# Altium project Bloco Motor.PrjPcb
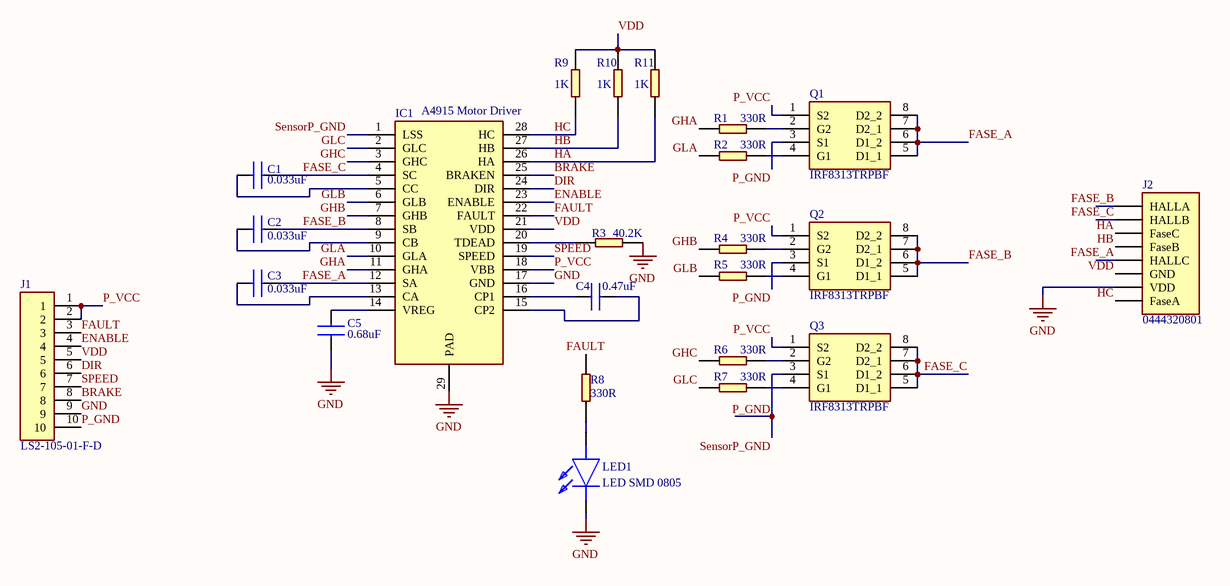
[diagram p0: BlocoMotor.SchDoc]
1 sheet, 23 parts. Net scope: global (net labels, ports and power ports of the same name join across sheets).
Board files: BlocoMotorFinal.PcbDoc, BlocoMotorReto.PcbDoc

## Sheet BlocoMotor.SchDoc
size A4; System: Connector

### Parts
C1  0.033uF  [CAP0805 50v]
C2  0.033uF  [CAP0805 50v]
C3  0.033uF  [CAP0805 50v]
C4  0.47uF  [CAP0805 50v]
C5  0.68uF  [CAP0805 50v]
IC1  A4915 Motor Driver  [A4915 Motor Driver]
J1  LS2-105-01-F-D  [CONN SINAL 10POS]
J2  0444320801  [CONN Main Motor]
LED1  LED SMD 0805  [LED SMD]
Q1  IRF8313TRPBF  [MOSFET MOTOR 2N-CH 30V 9.7A 8-SOIC]
Q2  IRF8313TRPBF  [MOSFET MOTOR 2N-CH 30V 9.7A 8-SOIC]
Q3  IRF8313TRPBF  [MOSFET MOTOR 2N-CH 30V 9.7A 8-SOIC]
R1  330R  [RES 0805]
R2  330R  [RES 0805]
R3  40.2K  [RES 0805]
R4  330R  [RES 0805]
R5  330R  [RES 0805]
R6  330R  [RES 0805]
R7  330R  [RES 0805]
R8  330R  [RES 0805]
R9  1K  [RES 0805]
R10  1K  [RES 0805]
R11  1K  [RES 0805]

### Nets
GND: C5.1 IC1.17(GND) IC1.29(PAD) J1.9 J2.7(VDD) LED1.1(K) R3.2
BRAKE: IC1.25(BRAKEN) J1.8
DIR: IC1.24(DIR) J1.6
ENABLE: IC1.23(ENABLE) J1.4
FASE_A: C3.1 IC1.12(SA) J2.5(HALLC) Q1.5(D1_1) Q1.6(D1_2) Q1.7(D2_1) Q1.8(D2_2)
FASE_B: C2.1 IC1.8(SB) J2.1(HALLA) Q2.5(D1_1) Q2.6(D1_2) Q2.7(D2_1) Q2.8(D2_2)
FASE_C: C1.1 IC1.4(SC) J2.2(HALLB) Q3.5(D1_1) Q3.6(D1_2) Q3.7(D2_1) Q3.8(D2_2)
FAULT: IC1.22(FAULT) J1.3 R8.1
GHA: IC1.11(GHA) R1.1
GHB: IC1.7(GHB) R4.1
GHC: IC1.3(GHC) R6.1
GLA: IC1.10(GLA) R2.1
GLB: IC1.6(GLB) R5.1
GLC: IC1.2(GLC) R7.1
HA: IC1.26(HA) J2.3(FaseC) R11.2
HB: IC1.27(HB) J2.4(FaseB) R10.2
HC: IC1.28(HC) J2.8(FaseA) R9.2
P_GND: IC1.1(LSS) J1.10 Q1.3(S1) Q2.3(S1) Q3.3(S1)  [also labelled SensorP_GND]
P_VCC: IC1.18(VBB) J1.1 J1.2 Q1.1(S2) Q2.1(S2) Q3.1(S2)
SPEED: IC1.19(SPEED) J1.7
VDD: IC1.21(VDD) J1.5 J2.6(GND) R9.1 R10.1 R11.1
NetC1_2: C1.2 IC1.5(CC)
NetC2_2: C2.2 IC1.9(CB)
NetC3_2: C3.2 IC1.13(CA)
NetC4_1: C4.1 IC1.15(CP2)
NetC4_2: C4.2 IC1.16(CP1)
NetC5_2: C5.2 IC1.14(VREG)
NetIC1_20: IC1.20(TDEAD) R3.1
NetLED1_2: LED1.2(A) R8.2
NetQ1_2: Q1.2(G2) R1.2
NetQ1_4: Q1.4(G1) R2.2
NetQ2_2: Q2.2(G2) R4.2
NetQ2_4: Q2.4(G1) R5.2
NetQ3_2: Q3.2(G2) R6.2
NetQ3_4: Q3.4(G1) R7.2

### Library data of the parts
C1-C5 = CAP 0805 50V: Capacitor / 08055A101JAT2A; Manufacturer_Name: AVX; Allied_Number: 70474488; Datasheet Link: https://componentsearchengine.com/Datasheets/1/06031A100FAT2A.pdf; Height: 0.94mm; Manufacturer_Part_Number: 08055A101JAT2A; Mouser Part Number: 581-08055A101J; Mouser Price/Stock: https://www.mouser.com/Search/Refine.aspx?Keyword=581-08055A101J; RS Part Number: 1243222; RS Price/Stock: https://uk.rs-online.com/web/p/products/1243222; Allied Price/Stock: https://www.alliedelec.com/avx-08055a101jat2a/70474488/
IC1 = A4915 Motor Driver: Integrated Circuit / 28-Pin TSSOP / with Exposed Thermal Pad / https://pdf1.alldatasheet.com/datasheet-pdf/view/848035/ALLEGRO/A4915.html; Manufacturer_Name: Allegro Microsystems; Manufacturer_Part_Number: A4915MLPTR-T; Datasheet Link: http://www.allegromicro.com/~/media/Files/Datasheets/A4915-Datasheet.ashx; Height: 1.2mm
J1 = CONN SInal Motor: CONN SELF-MATE 10POS VERT GOLD / SAM11451-ND / LS2-105-01-F-D; Manufacturer_Name: FCI; Manufacturer_Part_Number: 10132797-015100LF; System: Connector; Datasheet Link: https://www.amphenol-icc.com/media/wysiwyg/files/drawing/10132797.pdf; Height: 2mm; Mouser Part Number: 649-10132797015100LF; Mouser Price/Stock: https://www.mouser.com/Search/Refine.aspx?Keyword=649-10132797015100LF
J2 = CONN Main Motor: CONN HEADER VERT 8POS 3MM / 0444320801 / Connector Header Through Hole 8 position 0.118" (3.00mm); Manufacturer_Name: Molex; Manufacturer_Part_Number: 0444320802; Datasheet Link: http://static6.arrow.com/aropdfconversion/70af9c395913d6e0132bcfc0bf15a6e7757c94/0444320802_pcb_headers.pdf; Height: 11mm
LED1 = LED SMD 0805: LED / LED Indication - Discrete 2V 0805 (2012 Metric) / LTST-C170KRKT / 160-1415-1-ND; Manufacturer_Name: Lite-On; Datasheet Link: https://componentsearchengine.com/Datasheets/1/LTST-C170KRKT.pdf; Height: 1.2mm; Manufacturer_Part_Number: LTST-C170KRKT; Mouser Part Number: 859-LTST-C170KRKT; Mouser Price/Stock: https://www.mouser.com/Search/Refine.aspx?Keyword=859-LTST-C170KRKT; RS Part Number: 6920916P; RS Price/Stock: http://uk.rs-online.com/web/p/products/6920916P
Q1-Q3 = MOSFET MOTOR 2N-CH 30V 9.7A 8-SOIC: Mosfet Array 2 N-Channel (Dual) 30V 9.7A 2W Surface Mount 8-SO / IRF8313TRPBFTR-ND; Manufacturer_Name: Infineon; Allied_Number: 70018020; Datasheet Link: https://www.infineon.com/dgdl/irf8313pbf.pdf?fileId=5546d462533600a40153560d38521d63; Height: 1.75mm; Manufacturer_Part_Number: IRF8313TRPBF; Mouser Part Number: 942-IRF8313TRPBF; Mouser Price/Stock: https://www.mouser.com/Search/Refine.aspx?Keyword=942-IRF8313TRPBF; RS Part Number: 8273903; RS Price/Stock: https://uk.rs-online.com/web/p/products/8273903; Allied Price/Stock: https://www.alliedelec.com/infineon-irf8313trpbf/70018020/
R1-R11 = Resistor 0805: Resistor; Manufacturer_Name: TE Connectivity; Manufacturer_Part_Number: CPF0805B105RE1; Datasheet Link: http://docs-europe.electrocomponents.com/webdocs/13d1/0900766b813d116f.pdf; Height: 0.65mm; Mouser Part Number: 279-CPF0805B105RE1; Mouser Price/Stock: https://www.mouser.com/Search/Refine.aspx?Keyword=279-CPF0805B105RE1; RS Part Number: 1239398; RS Price/Stock: http://uk.rs-online.com/web/p/products/1239398